# EAGLE design b2 (EAGLE 9.6.2)
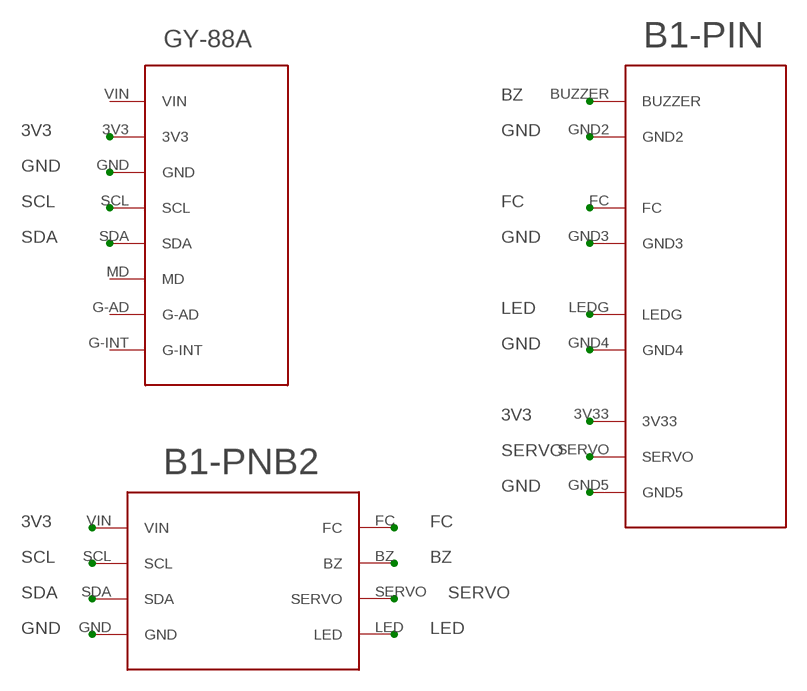
[diagram p0: schematic, sheet 1]

## Parts
U$1  GY-88A  [GY-88A]
U$2  PANEL  [PANEL]
U$4  B2-PINB1  [B2-PINB1]

## Nets
3V3: U$1.3V3 U$2.3V33 U$4.VIN
BZ: U$2.BUZZER U$4.BZ
FC: U$2.FC U$4.FC
GND: U$1.GND U$2.GND2 U$2.GND3 U$2.GND4 U$2.GND5 U$4.GND
LED: U$2.LEDG U$4.LED
SCL: U$1.SCL U$4.SCL
SDA: U$1.SDA U$4.SDA
SERVO: U$2.SERVO U$4.SERVO
Unconnected: U$1.G-AD U$1.G-INT U$1.MD U$1.VIN

## Library data of the parts
U$1 = CANSAT:GY-88A
U$2 = CANSAT:PANEL
U$4 = CANSAT:B2-PINB1

## Board
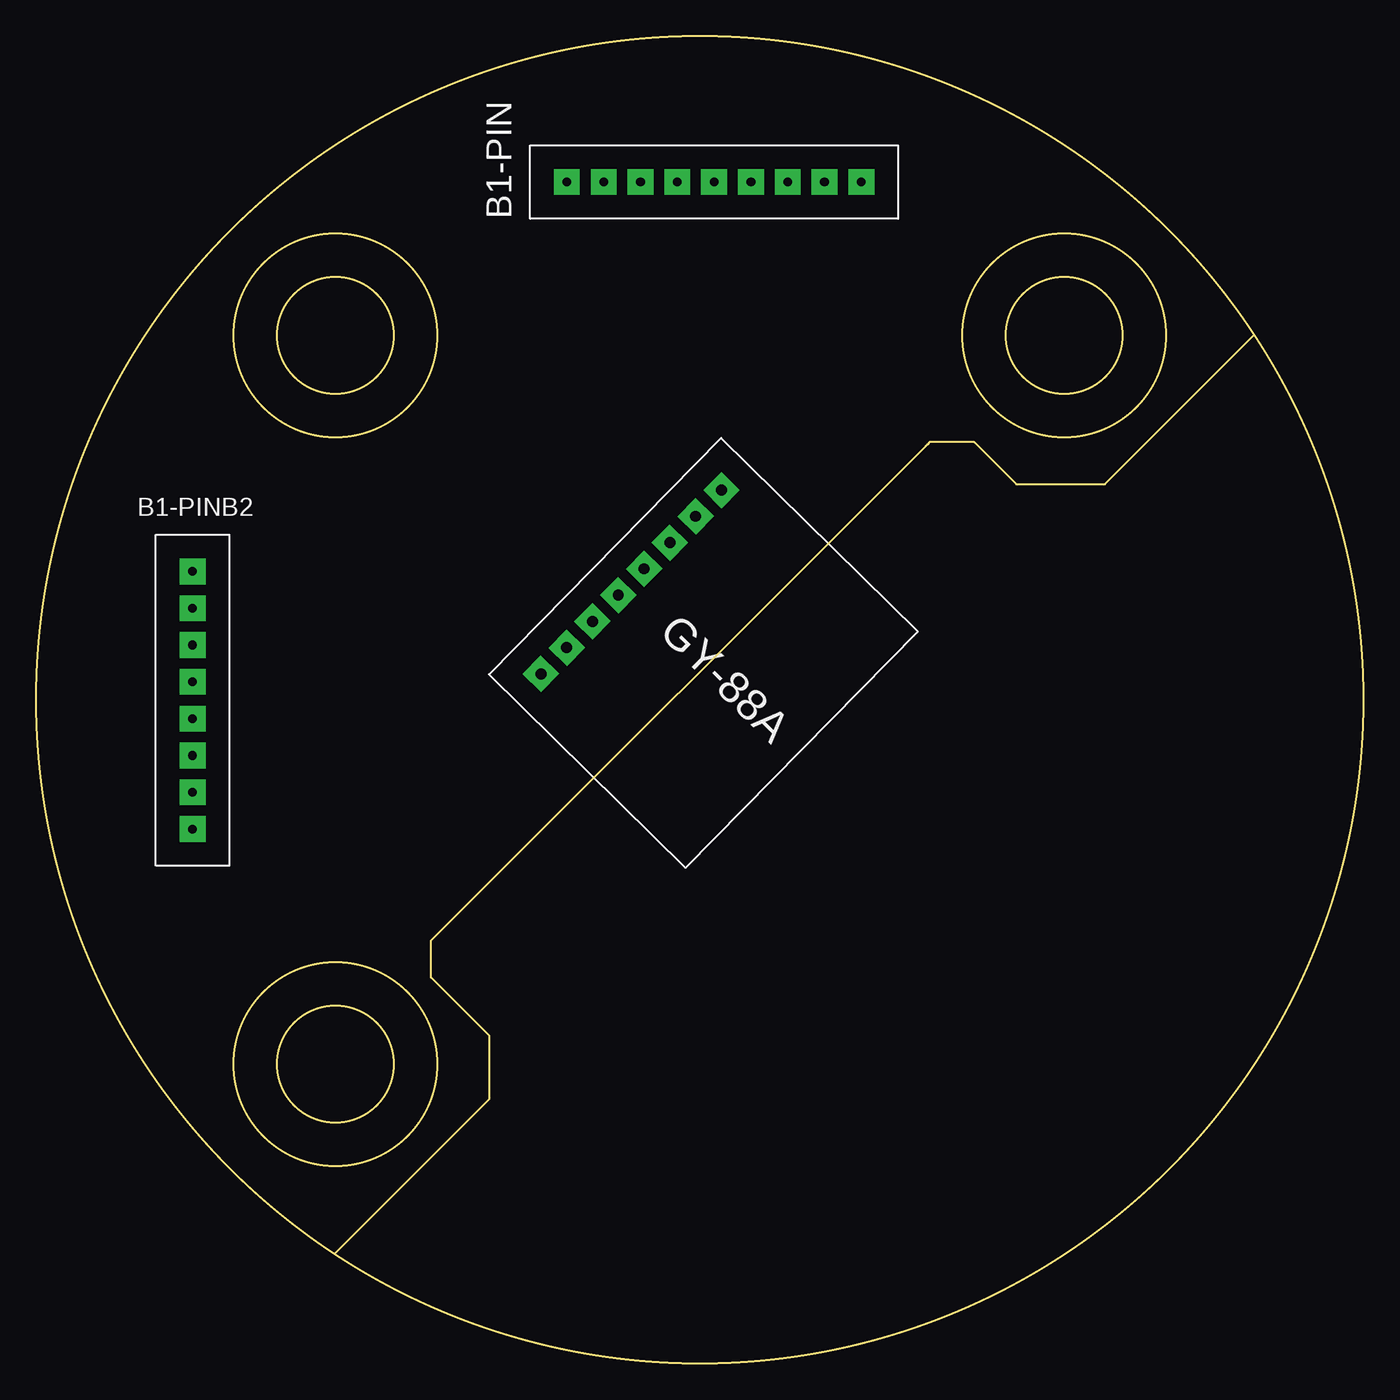
[diagram p1: board, top side]
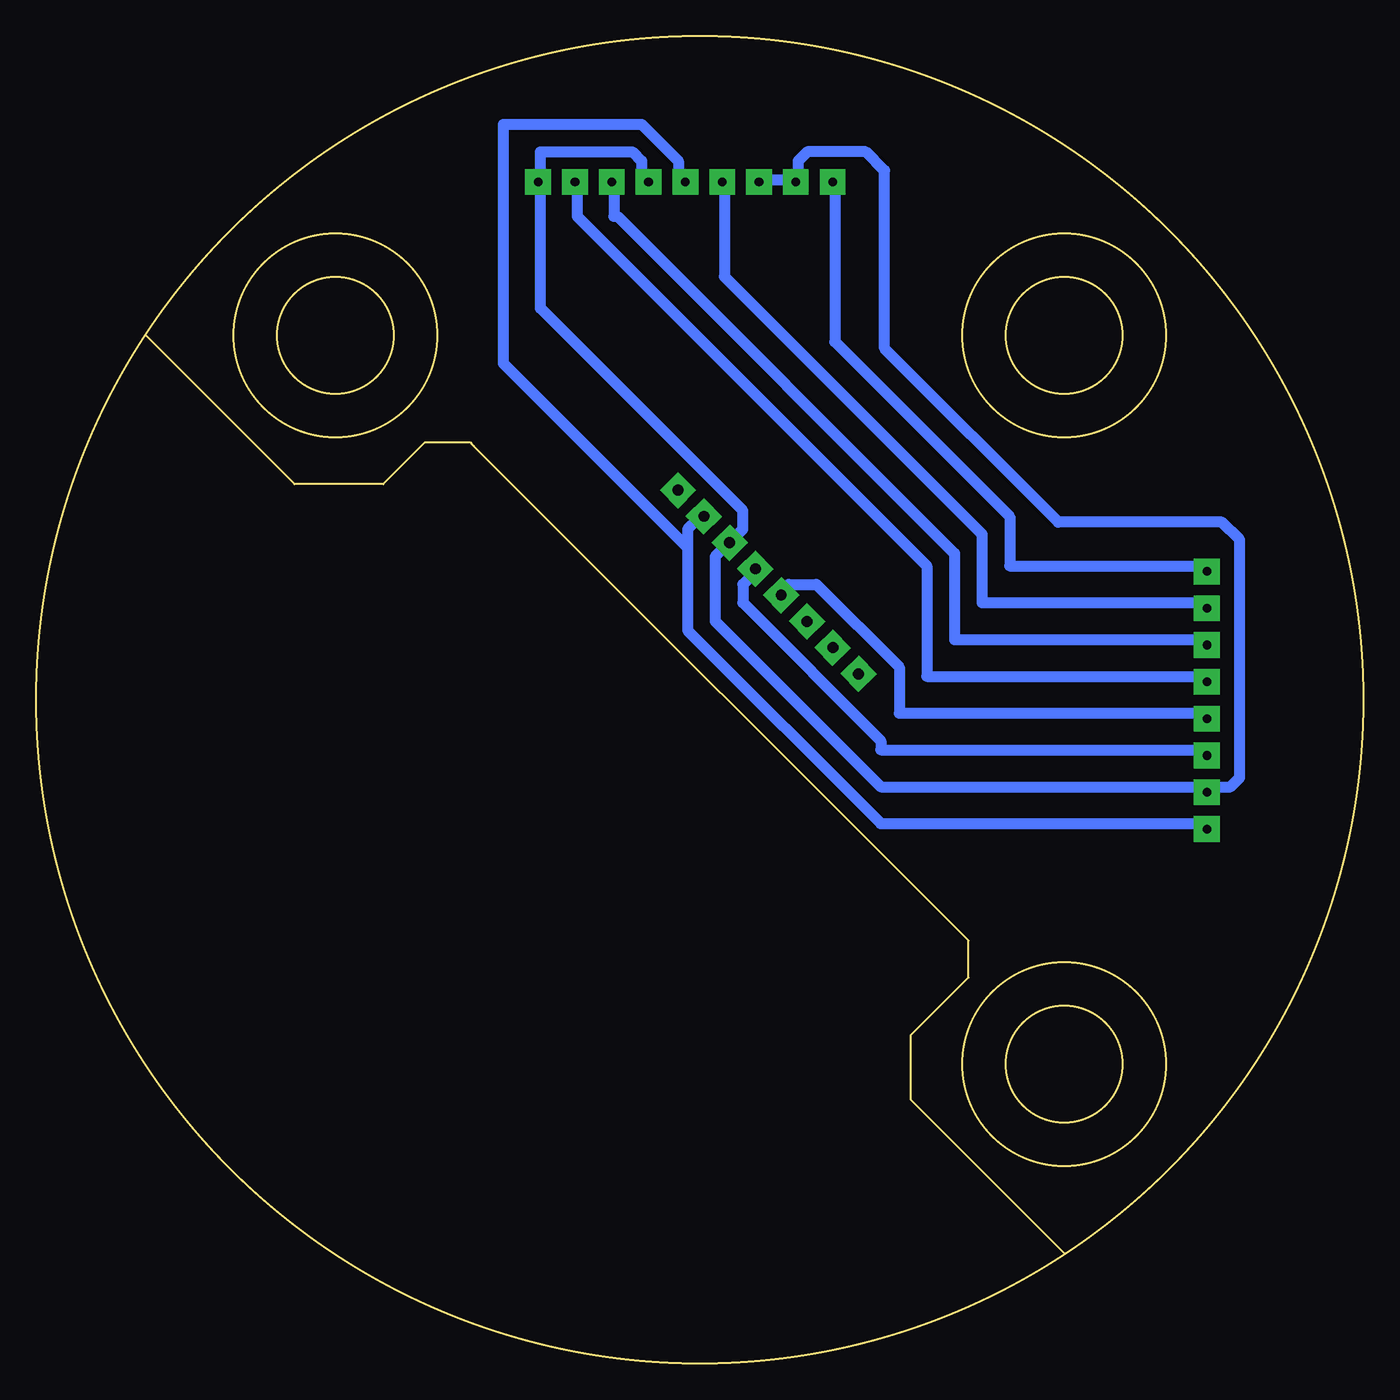
[diagram p2: board, bottom side, seen from below]

Size 91.58 x 91.58 mm. Coordinates in mm from the lower left corner, seen from the top.
Outline: 84.04,70.95 73.76,60.67 67.64,60.67 64.74,63.56 61.64,63.56 61.49,63.41 61.39,63.31 27.25,29.17 27.25,26.63 31.24,22.64 31.24,18.2 20.62,7.58
Outline: circle at 45.79,45.79 radius 45.79
Outline: circle at 20.65,20.65 radius 4
Outline: circle at 20.65,70.94 radius 4
Outline: circle at 70.94,70.94 radius 4
Outline: circle at 20.65,70.94 radius 7
Outline: circle at 70.94,70.94 radius 7
Outline: circle at 20.65,20.65 radius 7
Copper layers (1*16): Top 0.035mm / dielectric 1.5mm / Bottom 0.035mm
Design rules "default *": minimum track width 30mil, minimum drill 0.35mm, track to track 30mil, track to pad 30mil, pad to pad 6mil, via to via 6mil, smd to smd 6mil, copper to edge 30mil, drill to drill 6mil, minimum pad ring 10mil, minimum via ring 8mil, stop-mask expansion 4mil, vias tented up to drill 0mil, thermal gap 10mil

### Footprints (pad centres in the part's own frame; a part is rotated, then mirrored left to right if it is on the bottom)
GY-88A = drill 0.75 pad 1.778 square: 3V3 0,-2.54; G-AD 0,-15.24; G-INT 0,-17.78; GND 0,-5.08; MD 0,-12.7; SCL 0,-7.62; SDA 0,-10.16; VIN 0,0
PANEL = drill 0.6 pad 1.778 square: 3V33 6.35,-13.97; BUZZER 6.35,-21.59; FC 6.35,-19.05; GND2 6.35,-24.13; GND3 6.35,-16.51; GND4 6.35,-6.35; GND5 6.35,-8.89; LEDG 6.35,-3.81; SERVO 6.35,-11.43
B2-PINB1 = drill 0.6 pad 1.778 square: BZ 2.54,-10.16; FC 2.54,-7.62; GND 2.54,-17.78; LED 2.54,-2.54; SCL 2.54,-15.24; SDA 2.54,-12.7; SERVO 2.54,-5.08; VIN 2.54,-20.32

### Placement (x,y rotation side)
U$1  47.29,60.26 315.5 top
U$2  32.81,75.17 90 top
U$4  8.25,57.19 0 top

### Tracks (layer width: path | path; a pad name or v marks a point on that pad's centre or on a via)
3V3
  Bottom 0.762: 46.63,56.3 46.63,57.57 45.99,58.2 U$1.3V3 | 46.63,56.3 46.63,50.58 33.29,37.25 11.07,37.25 U$4.VIN | 46.63,56.3 59.33,69 59.33,85.51 49.8,85.51 47.26,82.97 47.26,81.7 U$2.3V33
BZ
  Bottom 0.762: U$4.BZ 11.07,47.41 30.12,47.41 30.12,55.03 54.25,79.16 54.25,81.06 U$2.BUZZER
FC
  Bottom 0.762: U$4.FC 11.07,49.95 28.21,49.95 28.21,55.89 51.48,79.16 51.71,79.16 51.71,81.06 U$2.FC
GND
  Bottom 0.762: U$2.GND3 49.8,81.7 49.8,82.97 50.44,83.6 56.79,83.6 56.79,81.7 U$2.GND2 56.79,81.06 56.79,72.81 42.82,58.84 42.82,57.57 43.45,56.93 U$1.GND 44.09,56.3 44.72,55.66 44.72,51.22 33.29,39.79 11.07,39.79 U$4.GND 10.43,39.79 9.16,39.79 8.53,40.42 8.53,56.83 9.75,58.05 21.05,58.05 33.04,70.04 33.04,82.31 34.34,83.6 38.37,83.6 39.01,82.97 39.01,81.7 U$2.GND4 39.64,81.7 41.55,81.7 U$2.GND5
LED
  Bottom 0.762: U$4.LED 11.07,55.03 24.4,55.03 24.4,58.43 36.47,70.5 36.47,81.06 U$2.LEDG
SCL
  Bottom 0.762: U$4.SCL 11.07,42.33 33.29,42.33 33.29,42.96 42.82,52.49 42.82,53.76 42.18,54.39 U$1.SCL
SDA
  Bottom 0.762: U$4.SDA 11.07,44.87 32.02,44.87 32.02,48.04 37.74,53.76 39.64,53.76 39.64,53.12 U$1.SDA
SERVO
  Bottom 0.762: U$4.SERVO 11.07,52.49 26.31,52.49 26.31,57.21 44.09,74.99 44.09,81.06 U$2.SERVO